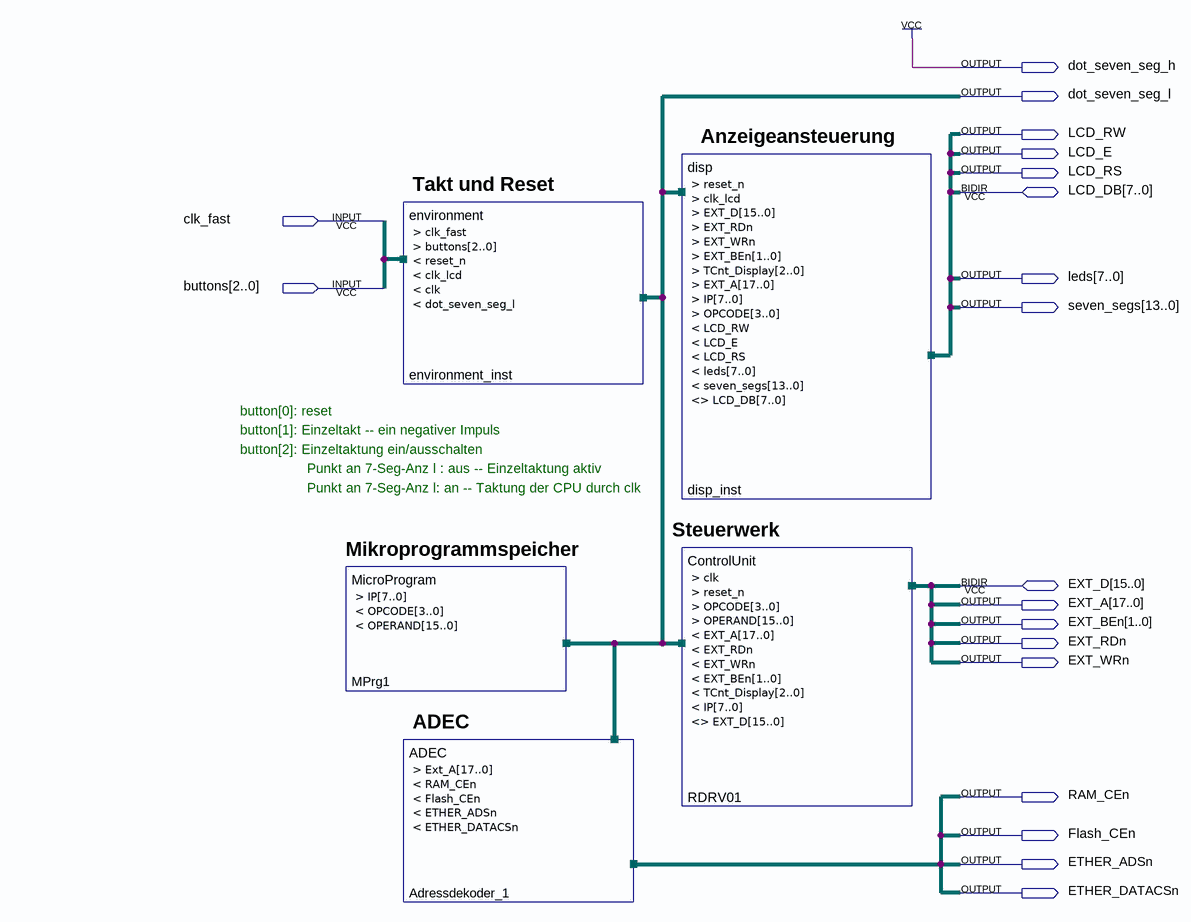
[diagram p0: schematic sheet]
// Quartus schematic CA2_SPT.bdf as structural Verilog: 5 symbols, 19 pins
module CA2_SPT (
  input  clk_fast,
  input  [2:0] buttons,
  inout  [7:0] LCD_DB,
  inout  [15:0] EXT_D,
  output dot_seven_seg_h,
  output dot_seven_seg_l,
  output LCD_RW,
  output LCD_E,
  output LCD_RS,
  output [7:0] leds,
  output [13:0] seven_segs,
  output [17:0] EXT_A,
  output [1:0] EXT_BEn,
  output EXT_RDn,
  output EXT_WRn,
  output RAM_CEn,
  output Flash_CEn,
  output ETHER_ADSn,
  output ETHER_DATACSn
);

  wire clk, clk_lcd, reset_n;
  wire [2:0] TCnt_Display;
  wire [3:0] OPCODE;
  wire [7:0] IP;
  wire [15:0] OPERAND;

  MicroProgram MPrg1 (.IP(IP), .OPCODE(OPCODE), .OPERAND(OPERAND));
  environment environment_inst (
    .clk_fast(clk_fast), .buttons(buttons), .reset_n(reset_n), .clk_lcd(clk_lcd), .clk(clk),
    .dot_seven_seg_l(dot_seven_seg_l));
  ADEC Adressdekoder_1 (
    .Ext_A(EXT_A), .RAM_CEn(RAM_CEn), .Flash_CEn(Flash_CEn), .ETHER_ADSn(ETHER_ADSn),
    .ETHER_DATACSn(ETHER_DATACSn));
  disp disp_inst (
    .reset_n(reset_n), .clk_lcd(clk_lcd), .EXT_D(EXT_D), .EXT_RDn(EXT_RDn), .EXT_WRn(EXT_WRn),
    .EXT_BEn(EXT_BEn), .TCnt_Display(TCnt_Display), .EXT_A(EXT_A), .IP(IP), .OPCODE(OPCODE), .LCD_RW(LCD_RW),
    .LCD_E(LCD_E), .LCD_RS(LCD_RS), .leds(leds), .seven_segs(seven_segs), .LCD_DB(LCD_DB));
  ControlUnit RDRV01 (
    .clk(clk), .reset_n(reset_n), .OPCODE(OPCODE), .OPERAND(OPERAND), .EXT_A(EXT_A), .EXT_RDn(EXT_RDn),
    .EXT_WRn(EXT_WRn), .EXT_BEn(EXT_BEn), .TCnt_Display(TCnt_Display), .IP(IP), .EXT_D(EXT_D));

  assign dot_seven_seg_h = 1'b1;

  // Notes on the sheet:
  //   Anzeigeansteuerung
  //   Takt und Reset
  //   button[0]: reset
  //   button[1]: Einzeltakt -- ein negativer Impuls
  //   button[2]: Einzeltaktung ein/ausschalten
  //   Punkt an 7-Seg-Anz l : aus -- Einzeltaktung aktiv
  //   Punkt an 7-Seg-Anz l: an -- Taktung der CPU durch clk
  //   Steuerwerk
  //   Mikroprogrammspeicher
  //   ADEC
endmodule
